# Altium schematic sheet Controller.SchDoc: Controller
size A3; SheetNumber: 3; SheetTotal: 7
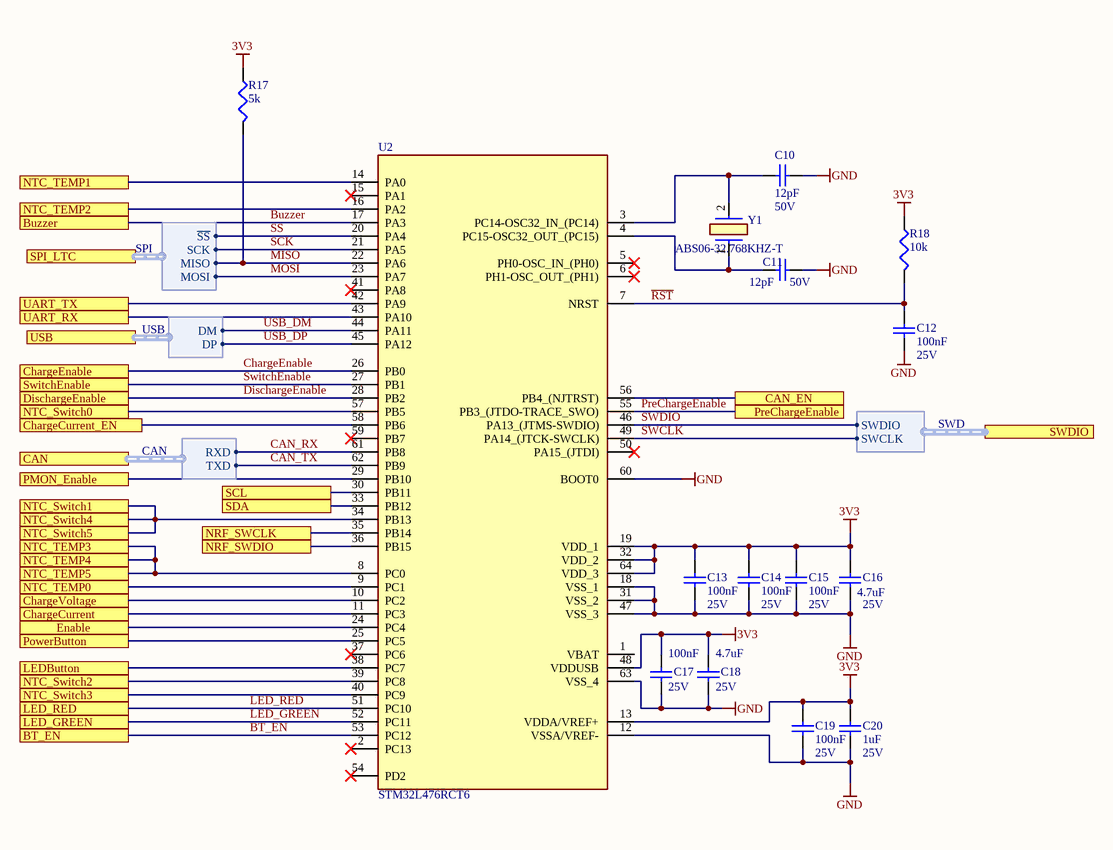
[diagram p0: Controller.SchDoc]

## Parts
C10  12pF  Voltage Rating: 50V  [C0402]
C11  12pF  Voltage Rating: 50V  [C0402]
C12  100nF  Voltage Rating: 25V  [C0402]
C13  100nF  Voltage Rating: 25V  [C0402]
C14  100nF  Voltage Rating: 25V  [C0402]
C15  100nF  Voltage Rating: 25V  [C0402]
C16  4.7uF  Voltage Rating: 25V  [C0402]
C17  100nF  Voltage Rating: 25V  [C0402]
C18  4.7uF  Voltage Rating: 25V  [C0402]
C19  100nF  Voltage Rating: 25V  [C0402]
C20  1uF  Voltage Rating: 25V  [C0402]
R17  5k  [0402]
R18  10k  [0402]
U2  STM32L476RCT6  [QFP50P1200X1200X160-64N]
Y1  ABS06-32.768KHZ-T  [OSC-SMD_L2.0-W1.2]

## Ports
BT_EN, Buzzer, CAN (harness CAN), CAN_EN, ChargeCurrent, ChargeCurrent_EN, ChargeEnable, ChargeVoltage, DischargeEnable, Enable, LED_GREEN, LED_RED, LEDButton, NRF_SWCLK, NRF_SWDIO, NTC_Switch0, NTC_Switch1, NTC_Switch2, NTC_Switch3, NTC_Switch4, NTC_Switch5, NTC_TEMP0, NTC_TEMP1, NTC_TEMP2, NTC_TEMP3, NTC_TEMP4, NTC_TEMP5, PMON_Enable, PowerButton, PreChargeEnable, SCL, SDA, SPI_LTC (harness SPI), SWDIO (harness SWD), SwitchEnable, UART_RX, UART_TX, USB (harness USB)

## Harnesses
USB: DM, DP
CAN: RXD, TXD
SPI: ~{SS}, SCK, MISO, MOSI
SWD: SWCLK, SWDIO

## Nets
3V3: C13.2 C14.2 C15.2 C16.2 C17.2 C18.2 C19.2 C20.2 R17.2 R18.2 U2.13(VDDA/VREF+) U2.19(VDD_1) U2.32(VDD_2) U2.48(VDDUSB) U2.64(VDD_3)
GND: C10.1 C11.1 C12.1 C13.1 C14.1 C15.1 C16.1 C17.1 C18.1 C19.1 C20.1 U2.12(VSSA/VREF-) U2.18(VSS_1) U2.31(VSS_2) U2.47(VSS_3) U2.60(BOOT0) U2.63(VSS_4)
BT_EN: U2.53(PC12) ; port BT_EN
Buzzer: U2.17(PA3) ; port Buzzer
CAN_EN: U2.56(PB4_(NJTRST)) ; port CAN_EN
CAN_RX: U2.61(PB8) ; port CAN.RXD
CAN_TX: U2.62(PB9) ; port CAN.TXD
ChargeCurrent: U2.11(PC3) ; port ChargeCurrent
ChargeCurrent_EN: U2.58(PB6) ; port ChargeCurrent_EN
ChargeEnable: U2.26(PB0) ; port ChargeEnable
ChargeVoltage: U2.10(PC2) ; port ChargeVoltage
DischargeEnable: U2.28(PB2) ; port DischargeEnable
Enable: U2.24(PC4) ; port Enable
LED_GREEN: U2.52(PC11) ; port LED_GREEN
LED_RED: U2.51(PC10) ; port LED_RED
LEDButton: U2.38(PC7) ; port LEDButton
MISO: R17.1 U2.22(PA6) ; port SPI_LTC.MISO
MOSI: U2.23(PA7) ; port SPI_LTC.MOSI
NRF_SWCLK: U2.35(PB14) ; port NRF_SWCLK
NRF_SWDIO: U2.36(PB15) ; port NRF_SWDIO
NTC_Switch0: U2.57(PB5) ; port NTC_Switch0
NTC_Switch1: U2.34(PB13) ; port NTC_Switch1, port NTC_Switch4, port NTC_Switch5
NTC_Switch2: U2.39(PC8) ; port NTC_Switch2
NTC_Switch3: U2.40(PC9) ; port NTC_Switch3
NTC_TEMP0: U2.9(PC1) ; port NTC_TEMP0
NTC_TEMP1: U2.14(PA0) ; port NTC_TEMP1
NTC_TEMP2: U2.16(PA2) ; port NTC_TEMP2
NTC_TEMP3: U2.8(PC0) ; port NTC_TEMP3, port NTC_TEMP4, port NTC_TEMP5
PMON_Enable: U2.29(PB10) ; port PMON_Enable
PowerButton: U2.25(PC5) ; port PowerButton
PreChargeEnable: U2.55(PB3_(JTDO-TRACE_SWO)) ; port PreChargeEnable
~{RST}: C12.2 R18.1 U2.7(NRST)
~{SS}: U2.20(PA4) ; port SPI_LTC.~{SS}
SCK: U2.21(PA5) ; port SPI_LTC.SCK
SCL: U2.30(PB11) ; port SCL
SDA: U2.33(PB12) ; port SDA
SWCLK: U2.49(PA14_(JTCK-SWCLK)) ; port SWDIO.SWCLK
SWDIO: U2.46(PA13_(JTMS-SWDIO)) ; port SWDIO.SWDIO
SwitchEnable: U2.27(PB1) ; port SwitchEnable
UART_RX: U2.43(PA10) ; port UART_RX
UART_TX: U2.42(PA9) ; port UART_TX
USB_DM: U2.44(PA11) ; port USB.DM
USB_DP: U2.45(PA12) ; port USB.DP
NetC10_2: C10.2 U2.3(PC14-OSC32_IN_(PC14)) Y1.2
NetC11_2: C11.2 U2.4(PC15-OSC32_OUT_(PC15)) Y1.1

Not connected (* = marked no-connect by the designer): U2 1(VBAT) 2(PC13)* 5(PH0-OSC_IN_(PH0))* 6(PH1-OSC_OUT_(PH1))* 15(PA1)* 37(PC6)* 41(PA8)* 50(PA15_(JTDI))* 54(PD2)* 59(PB7)*

## Notes on the sheet
- Title
- Size:
- Date:
- A3
- Number:
- Time:
- Revision:
- Sheet
- of
- File:

## Library data of the parts
C10 C11 = 18pF/0402/CER/50V: Capacitor, 18pF, 50V, NP0; Capacitance Tolerance: ± 5%; Capacitor Case Style: 0402; Brand Number: GRM1555C1H180JA01D; Brand: MURATA; Dielectric Characteristic: NP0; Capacitance: 18pF; Temperature Range: -55°C to 125°C; Price: 0,0177; Order Code Supplier: 1828876; Supplier: Farnell
C12-C20 = 100nF/0402/CER/25V: Capacitor, 100nF, 25V, X7R; Capacitance Tolerance: 10nF; Capacitor Case Style: 0402; Brand Number: GRM155R71E104KE14D; Brand: MULTICOMP; Dielectric Characteristic: X7R; Capacitance: 100nF; Temperature Range: -55 to +125 C; Price: 0,0225; Order Code Supplier: 2456106; Supplier: Farnell
R17 R18 = 10k/0402/0063W/50V: Resistor, 10k, 0.1%, 0.0625W, 50V, 100PPM, 0402; Brand: VISHAY DRALORIC; Brand Number: CRCW040210K0FKED; Power Rating: 0.063W; Case Style: 0402; Order Code Supplier: 2121730; Price: 0,0005; Resistance: 10k; Supplier: Farnell; Temperature Coefficient: ± 100PPM; Temperature Range: -55°C to +125°C; Voltage Rating: 50V
U2 = STM32L476RCT6: Integrated Circuit; Manufacturer_Name: STMicroelectronics; Datasheet Link: https://www.st.com/resource/en/datasheet/stm32l476rc.pdf; Height: 1.6mm; Manufacturer_Part_Number: STM32L476RCT6; Mouser Part Number: 511-STM32L476RCT6; Mouser Price/Stock: https://www.mouser.co.uk/ProductDetail/STMicroelectronics/STM32L476RCT6?qs=kWQV1gtkNnc7gr%2FH8RnQ7w%3D%3D; Arrow Part Number: STM32L476RCT6; Arrow Price/Stock: https://www.arrow.com/en/products/stm32l476rct6/stmicroelectronics?region=nac
Y1 = ABS06-32.768KHZ-T: Crystal or Oscillator; Manufacturer_Name: ABRACON; Manufacturer_Part_Number: ABS05-32.768KHZ-9-T; Datasheet Link: https://abracon.com/Resonators/ABS05.pdf; Height: 0.5mm; Mouser Part Number: 815-ABS05-32.768K9T; Mouser Price/Stock: https://www.mouser.co.uk/ProductDetail/ABRACON/ABS05-32.768KHZ-9-T?qs=Pyu0ZBy%2FIJbsNYnIET1z3A%3D%3D; Arrow Part Number: ABS05-32.768KHZ-9-T; Arrow Price/Stock: https://www.arrow.com/en/products/abs05-32.768khz-9-t/abracon?region=nac